# EAGLE design Nixie_power_supply (EAGLE 9.5.1)
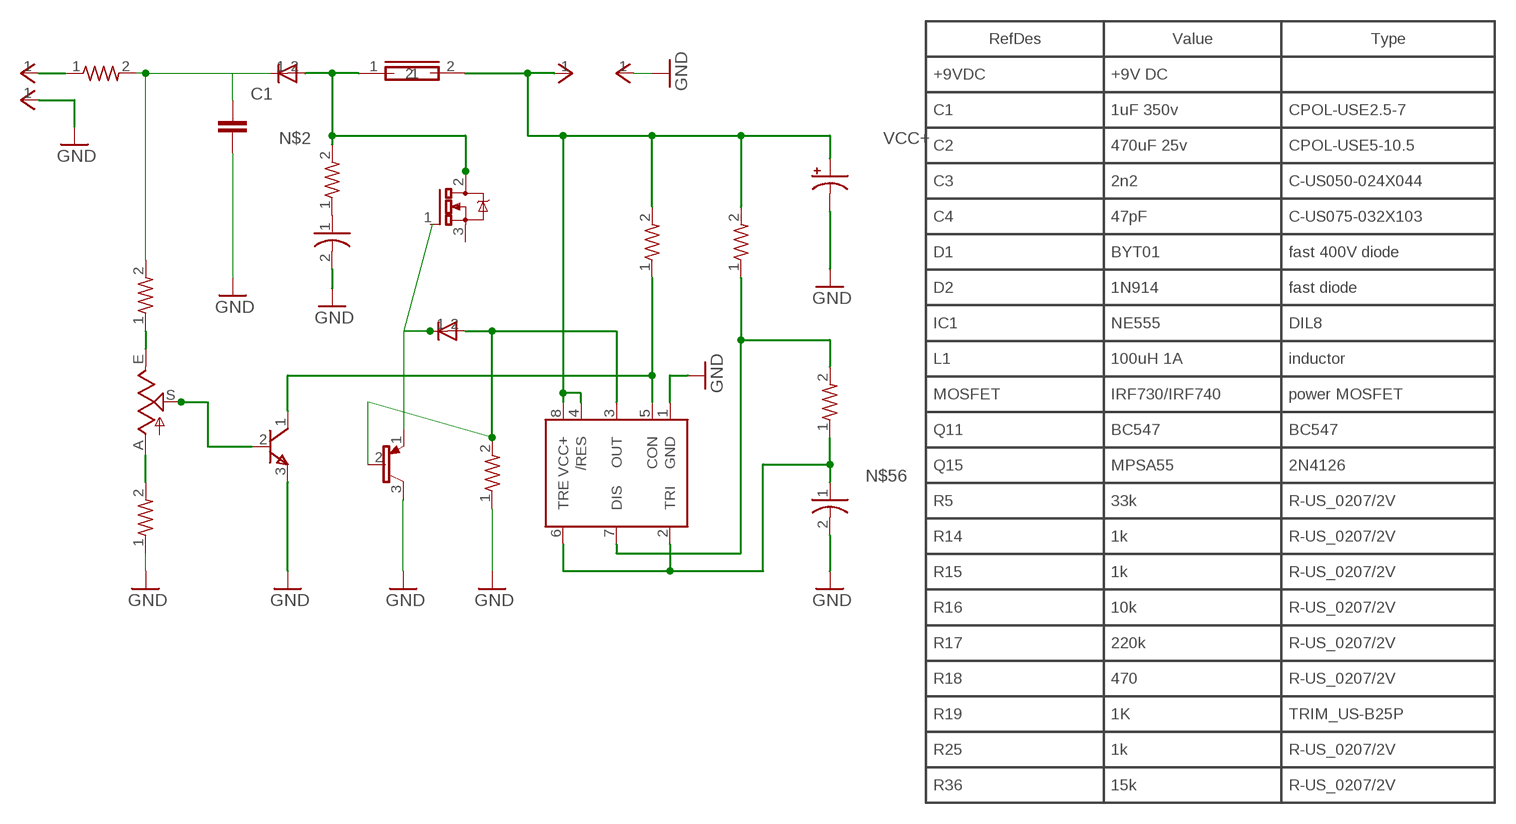
[diagram p0: schematic, sheet 1]

## Parts
ANODE  9V  ANODE  [1PIN]
C1  C  (no package)
C2  470uF 25v  CPOL-USSANYO_C6  [SANYO-OSCON_C6]
C3  2n2  C-US050-024X044  [CAP_CERAMIC_M]
C4  47pF  C-US075-032X103  [CAP_CERAMIC_M]
CATHODE  9V  CATHODE  [1PIN]
D1  BYT01  FAST_400V_DIODE  [DIODE_S]
D2  1N914  FAST_DIODE  [DIODE_ORIZZ_S]
GND  9V  CATHODE  [1PIN]
IC1  NE555  DIL8  [DIL-08]
L1  100uH 1A  INDUCTOR  [GENERIC_M]
MOSFET  IRF730/IRF740  POWER_MOSFET  [TO-220_VERT]
Q11  BC547  [TRANSISTOR_TO-92-100_L]
Q15  MPSA55  2N4126  [TRANSISTOR_TO-92-100]
R5  33k  R-US_0207/2V  [RES_ORIZZ_S]
R14  1k  R-US_0207/2V  [RES_ORIZZ_S]
R15  1k  R-US_0207/2V  [RES_ORIZZ_S]
R16  10k  R-US_0207/2V  [RES_ORIZZ_S]
R17  220k  R-US_0207/2V  [RES_ORIZZ_S]
R18  470  R-US_0207/2V  [RES_ORIZZ_S]
R19  1K  TRIM_US-B25P  [POT_QUAD_B25P]
R25  1k  R-US_0207/2V  [RES_ORIZZ_S]
R36  15k  R-US_0207/2V_1  [RES_ORIZZ_S]
VCC+  9V  ANODE  [1PIN]

## Nets
GND: C1.2 C2.- C3.2 C4.2 CATHODE.1(VCC) GND.1(VCC) IC1.1(GND) Q11.3(E) Q15.3(C) R18.1 R25.1
N$1: D2.1(C) MOSFET.1(G) Q15.1(E)
N$2: D1.2(A) L1.1 MOSFET.2(D) R15.2
N$4: C1.1 D1.1(C) R17.2 R36.2
N$8: C4.1 R15.1
N$46: R17.1 R19.E
N$50: IC1.7(DIS) R14.1 R16.2
N$54: IC1.5(CON) Q11.1(C) R5.1
N$56: C3.1 IC1.2(TRI) IC1.6(TRE) R16.1
NET_13: ANODE.1(VCC) R36.1
NET_65: R18.2 R19.A
NET_69: Q11.2(B) R19.S
NET_71: D2.2(A) IC1.3(OUT) Q15.2(B) R25.2
VCC+: C2.+ IC1.4(/RES) IC1.8(VCC+) L1.2 R5.2 R14.2 VCC+.1(VCC)
Unconnected: MOSFET.3(S)

## Notes on the sheet
- RefDes | Value | Type
- +9VDC | +9V DC
- C1 | 1uF 350v | CPOL-USE2.5-7
- C2 | 470uF 25v | CPOL-USE5-10.5
- C3 | 2n2 | C-US050-024X044
- C4 | 47pF | C-US075-032X103
- D1 | BYT01 | fast 400V diode
- D2 | 1N914 | fast diode
- IC1 | NE555 | DIL8
- L1 | 100uH 1A | inductor
- MOSFET | IRF730/IRF740 | power MOSFET
- Q11 | BC547 | BC547
- Q15 | MPSA55 | 2N4126
- R5 | 33k | R-US_0207/2V
- R14 | 1k | R-US_0207/2V
- R15 | 1k | R-US_0207/2V
- R16 | 10k | R-US_0207/2V
- R17 | 220k | R-US_0207/2V
- R18 | 470 | R-US_0207/2V
- R19 | 1K | TRIM_US-B25P
- R25 | 1k | R-US_0207/2V
- R36 | 15k | R-US_0207/2V

## Library data of the parts
ANODE VCC+ = common:ANODE
C1 = ngspice-simulation:C: CAPACITOR
C2 = rcl:CPOL-US: POLARIZED CAPACITOR, American symbol; SPICEPREFIX: C
C3 = common:C-US050-024X044
C4 = common:C-US075-032X103
CATHODE GND = common:CATHODE
D1 = common:FAST_400V_DIODE
D2 = common:FAST_DIODE
IC1 = common:DIL8
L1 = common:INDUCTOR
MOSFET = common:POWER_MOSFET
Q11 = common:BC547; DATASHEET: http://www.datasheetarchive.com/pdf-datasheets/Databooks-5/Document249234.html
Q15 = common:2N4126
R5 = common:R-US_0207/2V
R14-R18 R25 = common:R-US_0207/2V; VALUE: 33k
R19 = common:TRIM_US-B25P
R36 = common:R-US_0207/2V_1

## Board
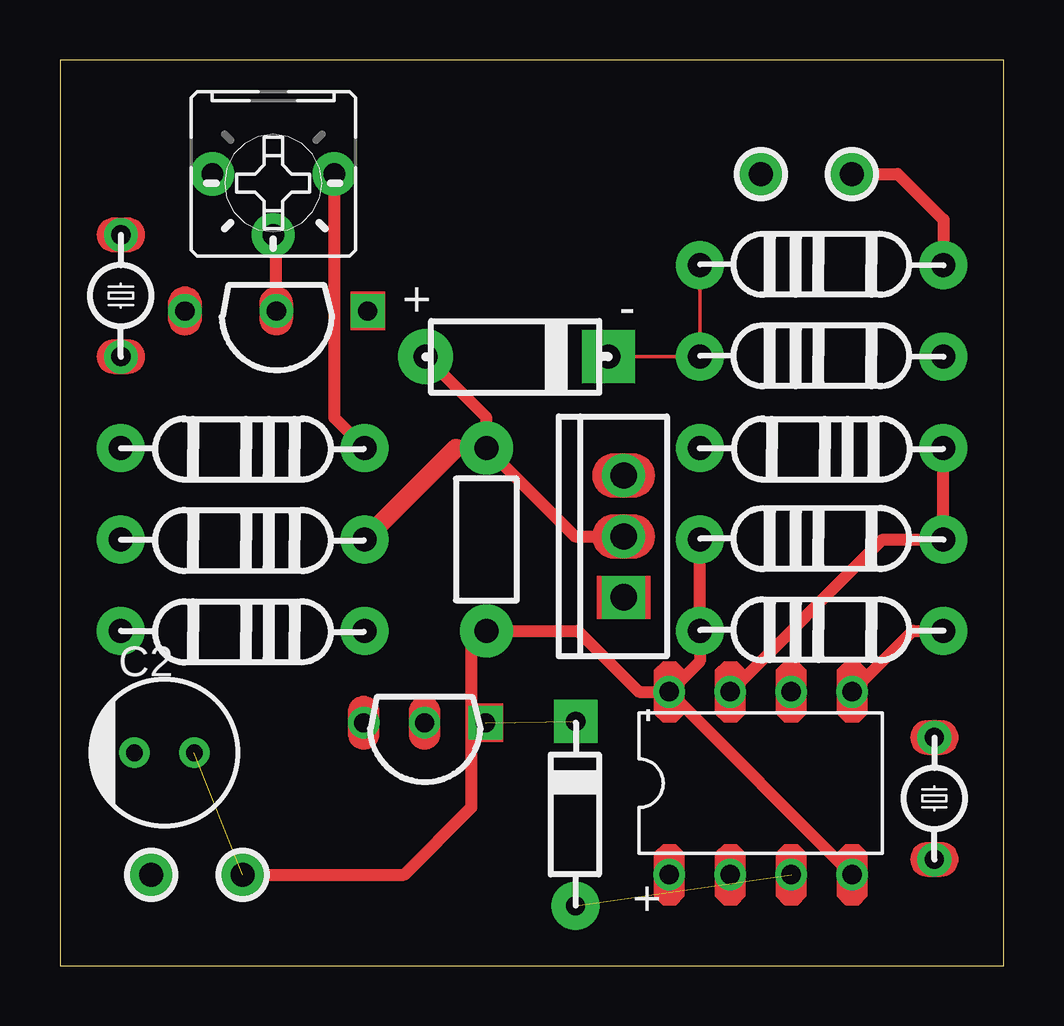
[diagram p1: board, top side]
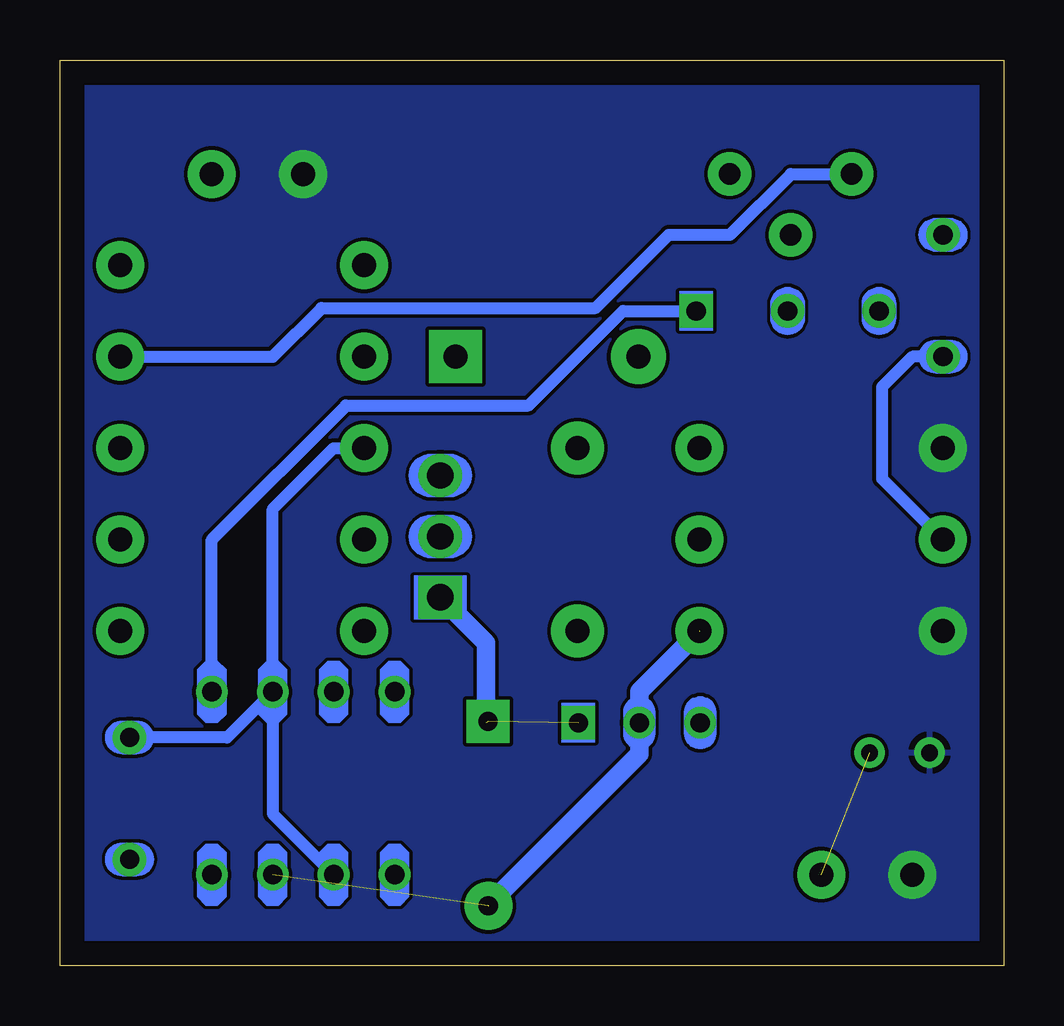
[diagram p2: board, bottom side, seen from below]

Size 39.35 x 37.77 mm. Coordinates in mm from the lower left corner, seen from the top.
Outline: 0,0 39.35,0 39.35,37.77 0,37.77 0,0
Copper layers (1*16): Top 0.035mm / dielectric 1.5mm / Bottom 0.035mm
Design rules "default": minimum track width 6mil, minimum drill 0.35mm, track to track 6mil, track to pad 6mil, pad to pad 6mil, via to via 6mil, smd to smd 6mil, copper to edge 40mil, drill to drill 6mil, minimum pad ring 10mil, minimum via ring 8mil, stop-mask expansion 4mil, vias tented up to drill 0mil, thermal gap 10mil

### Footprints (pad centres in the part's own frame; a part is rotated, then mirrored left to right if it is on the bottom)
1PIN = drill 1 pad 2: 1 0,0
SANYO-OSCON_C6 = drill 0.7 pad 1.27: + 1.25,0; - -1.25,0
CAP_CERAMIC_M = drill 0.8 pad 1.4: 1 -2.54,0; 2 2.54,0
DIODE_S = drill 1 pad 2.2 square: 1 -3.81,0 | drill 1 pad 2.3: 2 3.81,0
DIODE_ORIZZ_S = drill 0.8 pad 1.8 square: 1 -3.851,0.003 | drill 0.8 pad 2: 2 3.836,-0.008
DIL-08 = drill 0.813 pad 1.22: 1 -3.81,-3.81; 2 -1.27,-3.81; 3 1.27,-3.81; 4 3.81,-3.81; 5 3.81,3.81; 6 1.27,3.81; 7 -1.27,3.81; 8 -3.81,3.81
GENERIC_M = drill 1 pad 2.2: 1 -3.81,0; 2 3.81,0
TO-220_VERT = drill 1.1 pad 1.8 square: 1 -2.54,0 | drill 1.1 pad 1.8: 2 0,0; 3 2.54,0
TRANSISTOR_TO-92-100_L = drill 0.8 pad 1.4 square: 1 -3.81,0 | drill 0.8 pad 1.4: 2 0,0; 3 3.81,0
TRANSISTOR_TO-92-100 = drill 0.8 pad 1.4 square: 1 -2.54,0 | drill 0.8 pad 1.3: 2 0,0; 3 2.54,0
RES_ORIZZ_S = drill 1 pad 2: 1 -5.08,0; 2 5.08,0
POT_QUAD_B25P = drill 0.9 pad 1.8: A -2.54,0; E 2.54,0; S 0,2.54

### Placement (x,y rotation side)
ANODE  33.02,33.02 270 top
C2  4.35,8.89 0 top
C3  36.45,6.98 270 top
C4  2.54,27.94 90 top
CATHODE  29.21,33.02 270 top
D1  19.05,25.4 180 top
D2  21.5,6.34 270 top
GND  3.81,3.81 0 top
IC1  29.21,7.62 0 top
L1  17.78,17.78 270 top
MOSFET  23.5,17.91 90 top
Q11  9.02,27.3 180 top
Q15  15.2,10.14 180 top
R5  31.75,13.97 180 top
R14  31.75,17.78 180 top
R15  7.62,17.78 0 top
R16  31.75,21.59 0 top
R17  31.75,25.4 180 top
R18  7.62,21.59 0 top
R19  8.89,33.02 180 top
R25  7.62,13.97 0 top
R36  31.75,29.21 180 top
VCC+  7.62,3.81 0 top

### Tracks (layer width: path | path; a pad name or v marks a point on that pad's centre or on a via)
GND
  pour Bottom: -6.35,52.07 -6.35,-7.62 40.64,-7.62 40.64,52.07
N$1  (2 unrouted)
  Bottom 0.762: MOSFET.1 21.59,13.46 21.59,10.16
N$2
  Top 0.508: 16.51,21.59 L1.1 | L1.1 17.78,22.86 D1.2 | L1.1 21.46,17.91 MOSFET.2
  Top 0.762: 16.51,21.59 R15.2
N$4
  Top 0.152: R36.2 R17.2 D1.1
N$8
  Bottom 0.508: C4.1 3.81,25.4 5.08,24.13 5.08,20.32 R15.1
N$46
  Bottom 0.508: R17.1 30.48,25.4 28.45,27.43 17.02,27.43 13.97,30.48 11.43,30.48 8.89,33.02 R19.E
N$50
  Top 0.508: IC1.7 34.29,17.78 R14.1 R16.2
N$54
  Top 0.508: IC1.5 35.56,13.97 R5.1
  Bottom 0.508: IC1.5 33.02,17.78 27.43,23.37 19.81,23.37 15.88,27.3 Q11.1
N$56
  Bottom 0.508: IC1.6 30.48,19.05 27.94,21.59 R16.1 | IC1.6 30.48,6.35 IC1.2 | IC1.6 32.39,9.52 C3.1
NET_13
  Top 0.508: ANODE.1 34.92,33.02 36.83,31.12 R36.1
NET_65
  Top 0.508: R19.A 11.43,22.86 R18.2
NET_69
  Top 0.508: Q11.2 9.02,30.35 R19.S
NET_71  (3 unrouted)
  Bottom 0.762: 12.7,13.94 15.2,11.44 Q15.2 15.2,8.84 21.5,2.54
VCC+  (1 unrouted)
  Top 0.508: IC1.8 IC1.4 | IC1.8 26.67,12.7 R5.2 R14.2 | VCC+.1 14.35,3.81 17.14,6.6 17.14,13.34 L1.2 21.59,13.97 24.13,11.43 IC1.8